# Altium schematic sheet Top_Level.SchDoc
size A; SheetNumber: 1; SheetTotal: 5
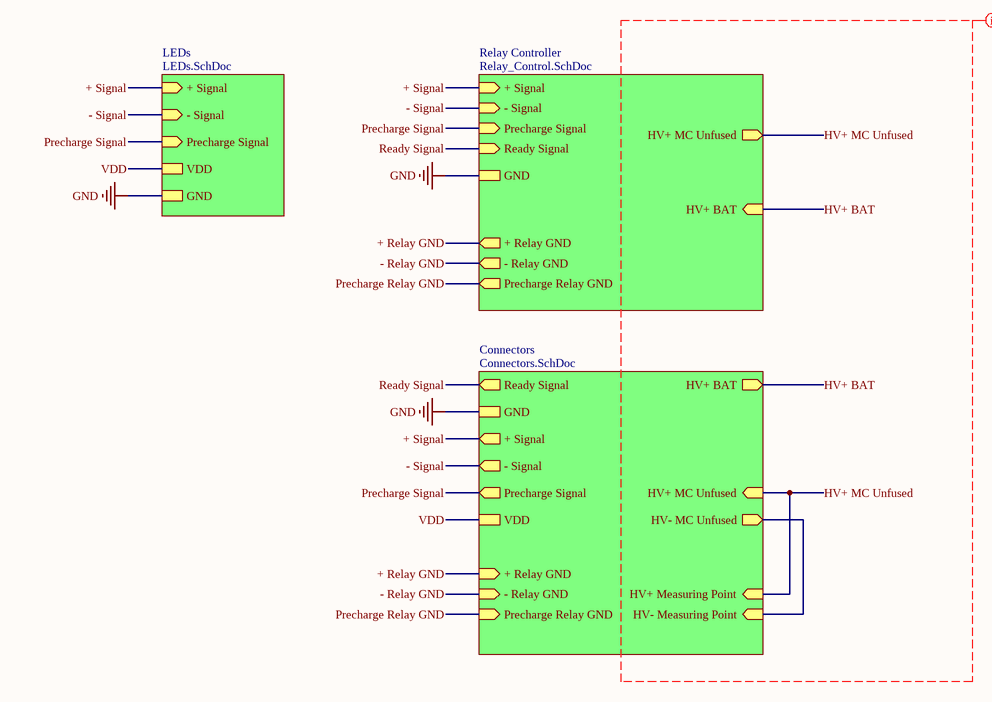
[diagram p0: Top_Level.SchDoc]

## Sub-sheets
Connectors = Connectors.SchDoc: Ready Signal (out), GND, + Signal (out), - Signal (out), Precharge Signal (out), + Relay GND (in), - Relay GND (in), Precharge Relay GND (in), HV+ BAT (out), VDD, HV+ MC Unfused (in), HV- Measuring Point (in), HV+ Measuring Point (in), HV- MC Unfused (out)
LEDs = LEDs.SchDoc: + Signal (in), - Signal (in), Precharge Signal (in), VDD, GND
Relay Controller = Relay_Control.SchDoc: + Signal (in), - Signal (in), Precharge Signal (in), Ready Signal (in), GND, + Relay GND (out), - Relay GND (out), Precharge Relay GND (out), HV+ MC Unfused (out), HV+ BAT (in)

## Nets
GND: sheet Relay Controller/GND, sheet Connectors/GND, sheet LEDs/GND
+ Relay GND: sheet Relay Controller/+ Relay GND, sheet Connectors/+ Relay GND
+ Signal: sheet Relay Controller/+ Signal, sheet Connectors/+ Signal, sheet LEDs/+ Signal
- Relay GND: sheet Relay Controller/- Relay GND, sheet Connectors/- Relay GND
- Signal: sheet Relay Controller/- Signal, sheet Connectors/- Signal, sheet LEDs/- Signal
HV+ BAT: sheet Relay Controller/HV+ BAT, sheet Connectors/HV+ BAT
HV+ MC Unfused: sheet Relay Controller/HV+ MC Unfused, sheet Connectors/HV+ MC Unfused, sheet Connectors/HV+ Measuring Point
Precharge Relay GND: sheet Relay Controller/Precharge Relay GND, sheet Connectors/Precharge Relay GND
Precharge Signal: sheet Relay Controller/Precharge Signal, sheet Connectors/Precharge Signal, sheet LEDs/Precharge Signal
Ready Signal: sheet Relay Controller/Ready Signal, sheet Connectors/Ready Signal
VDD: sheet Connectors/VDD, sheet LEDs/VDD
(unnamed): sheet Connectors/HV- Measuring Point, sheet Connectors/HV- MC Unfused

## Layout directives
mark named HIGH VOLTAGE: HV+ BAT, HV+ MC Unfused